# EAGLE schematic BMS Layout rev5 (EAGLE 9.2.2)
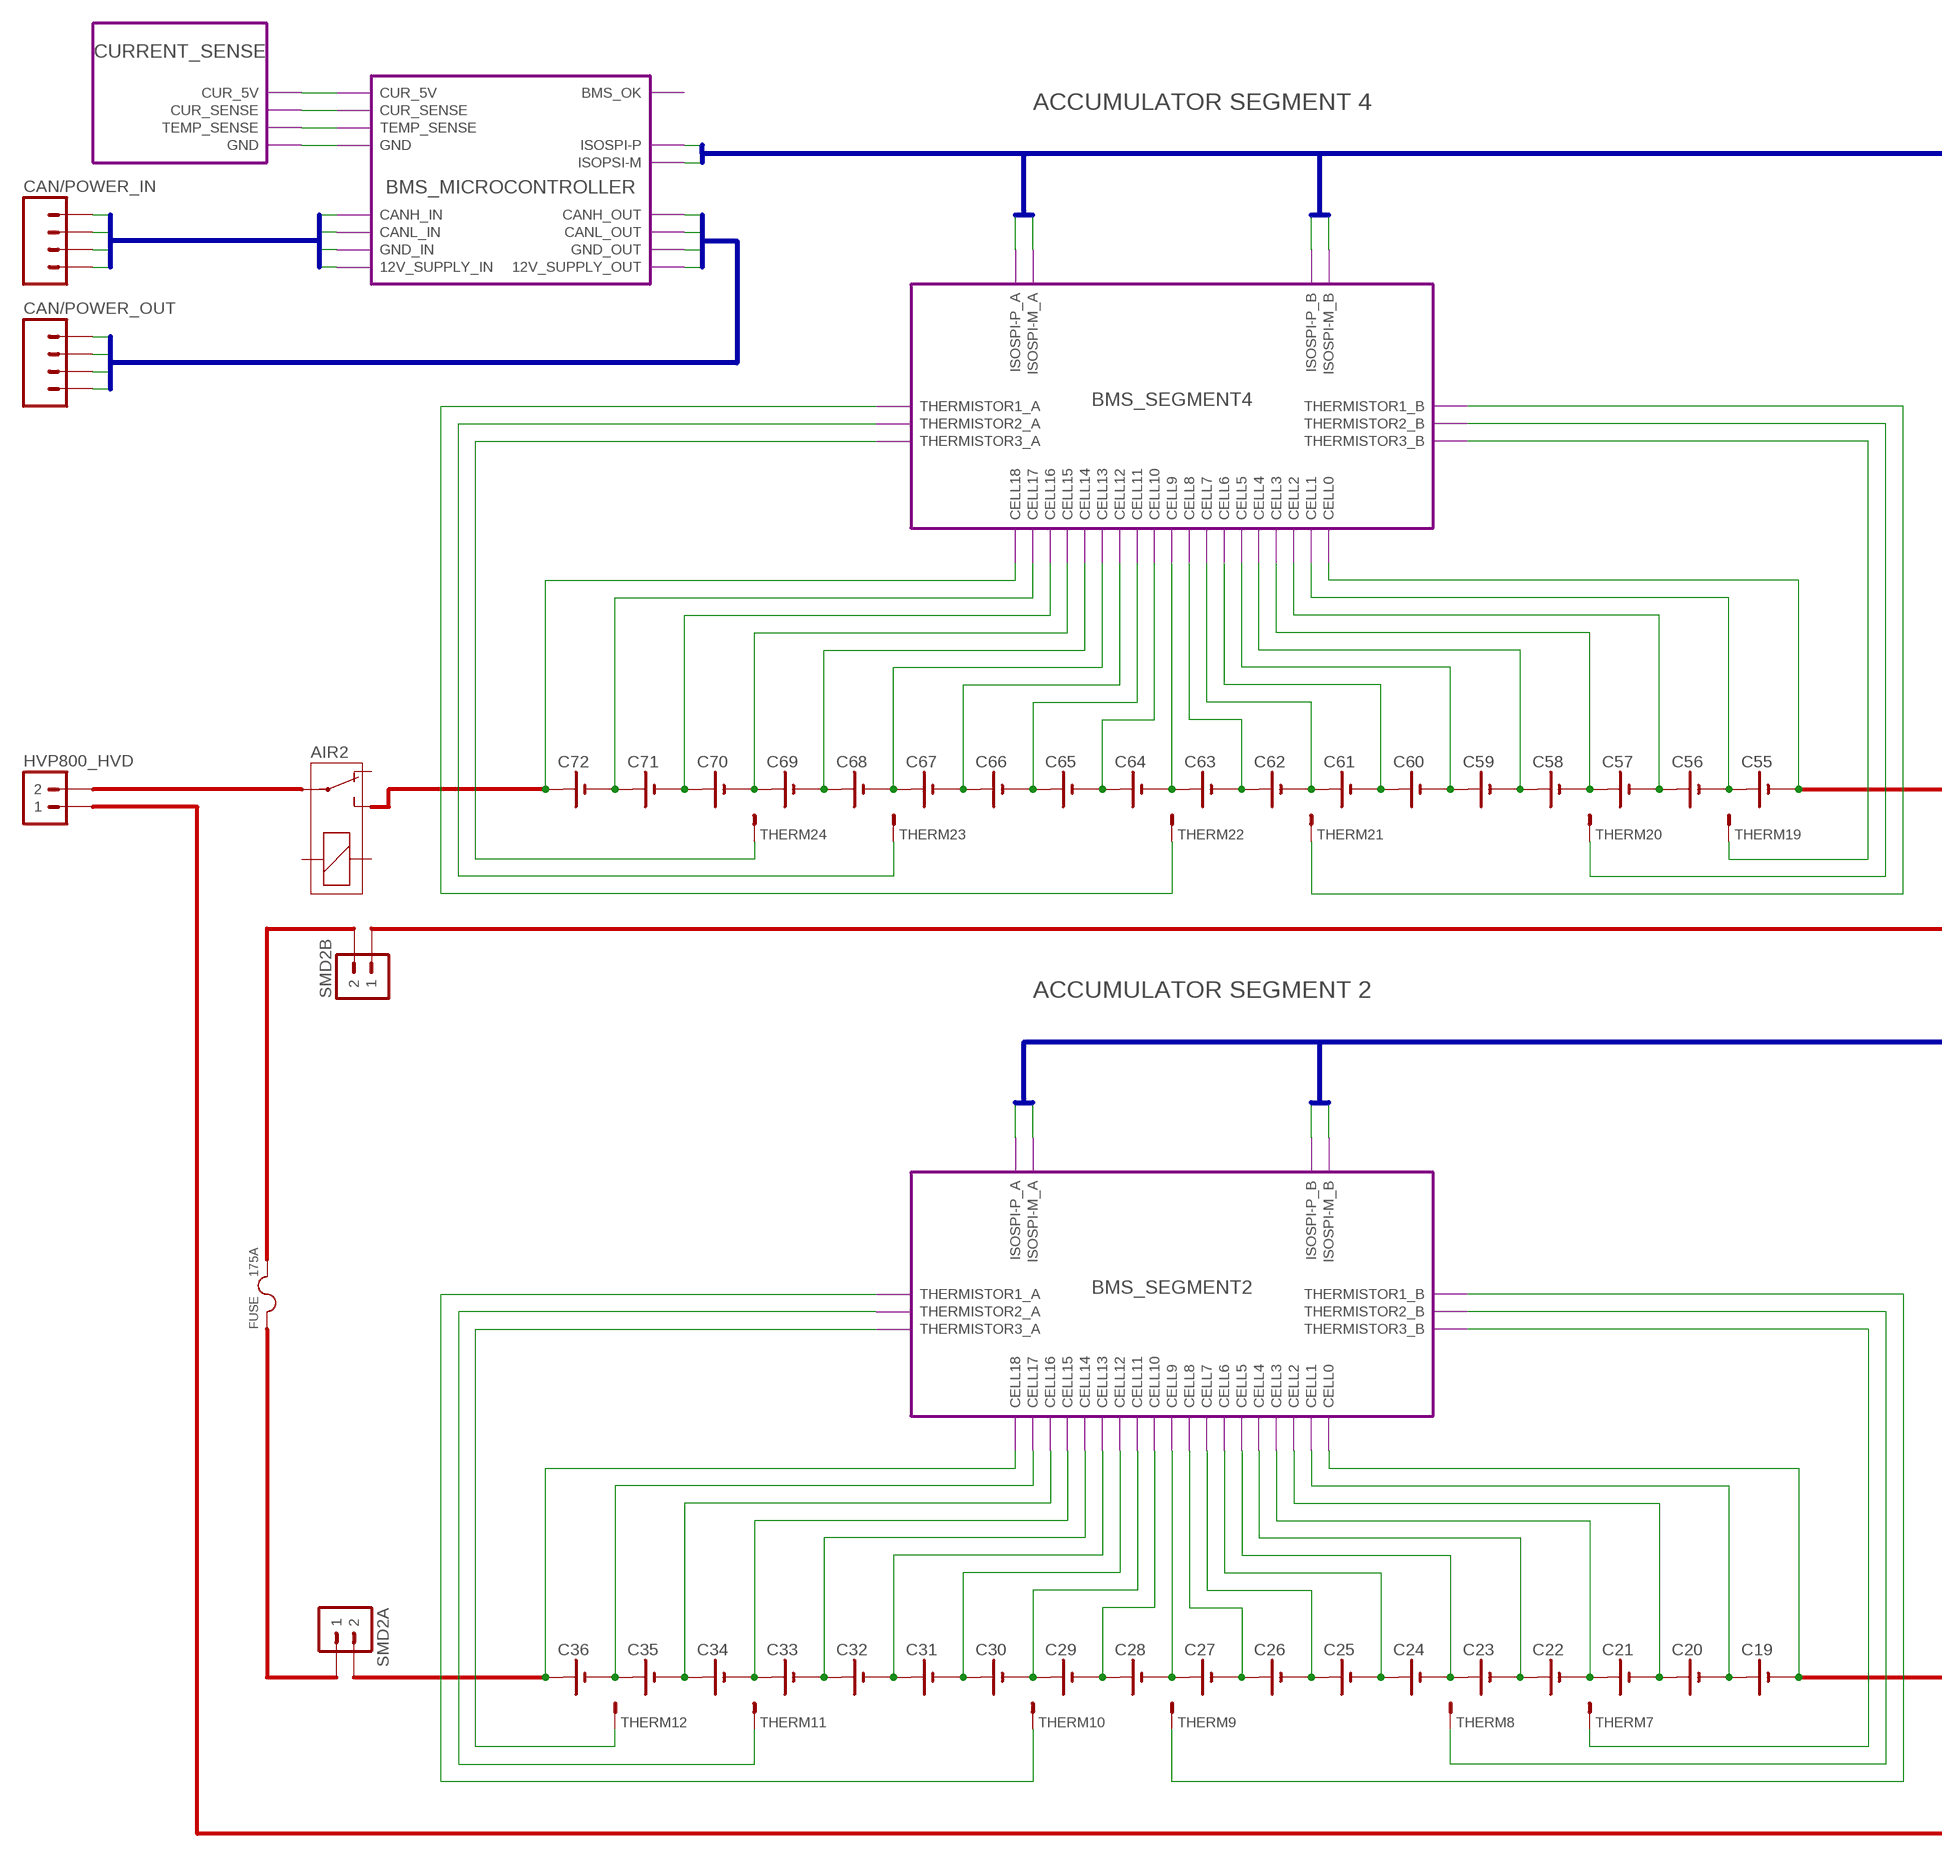
[diagram p0: schematic, sheet 1, part 1 of 2]
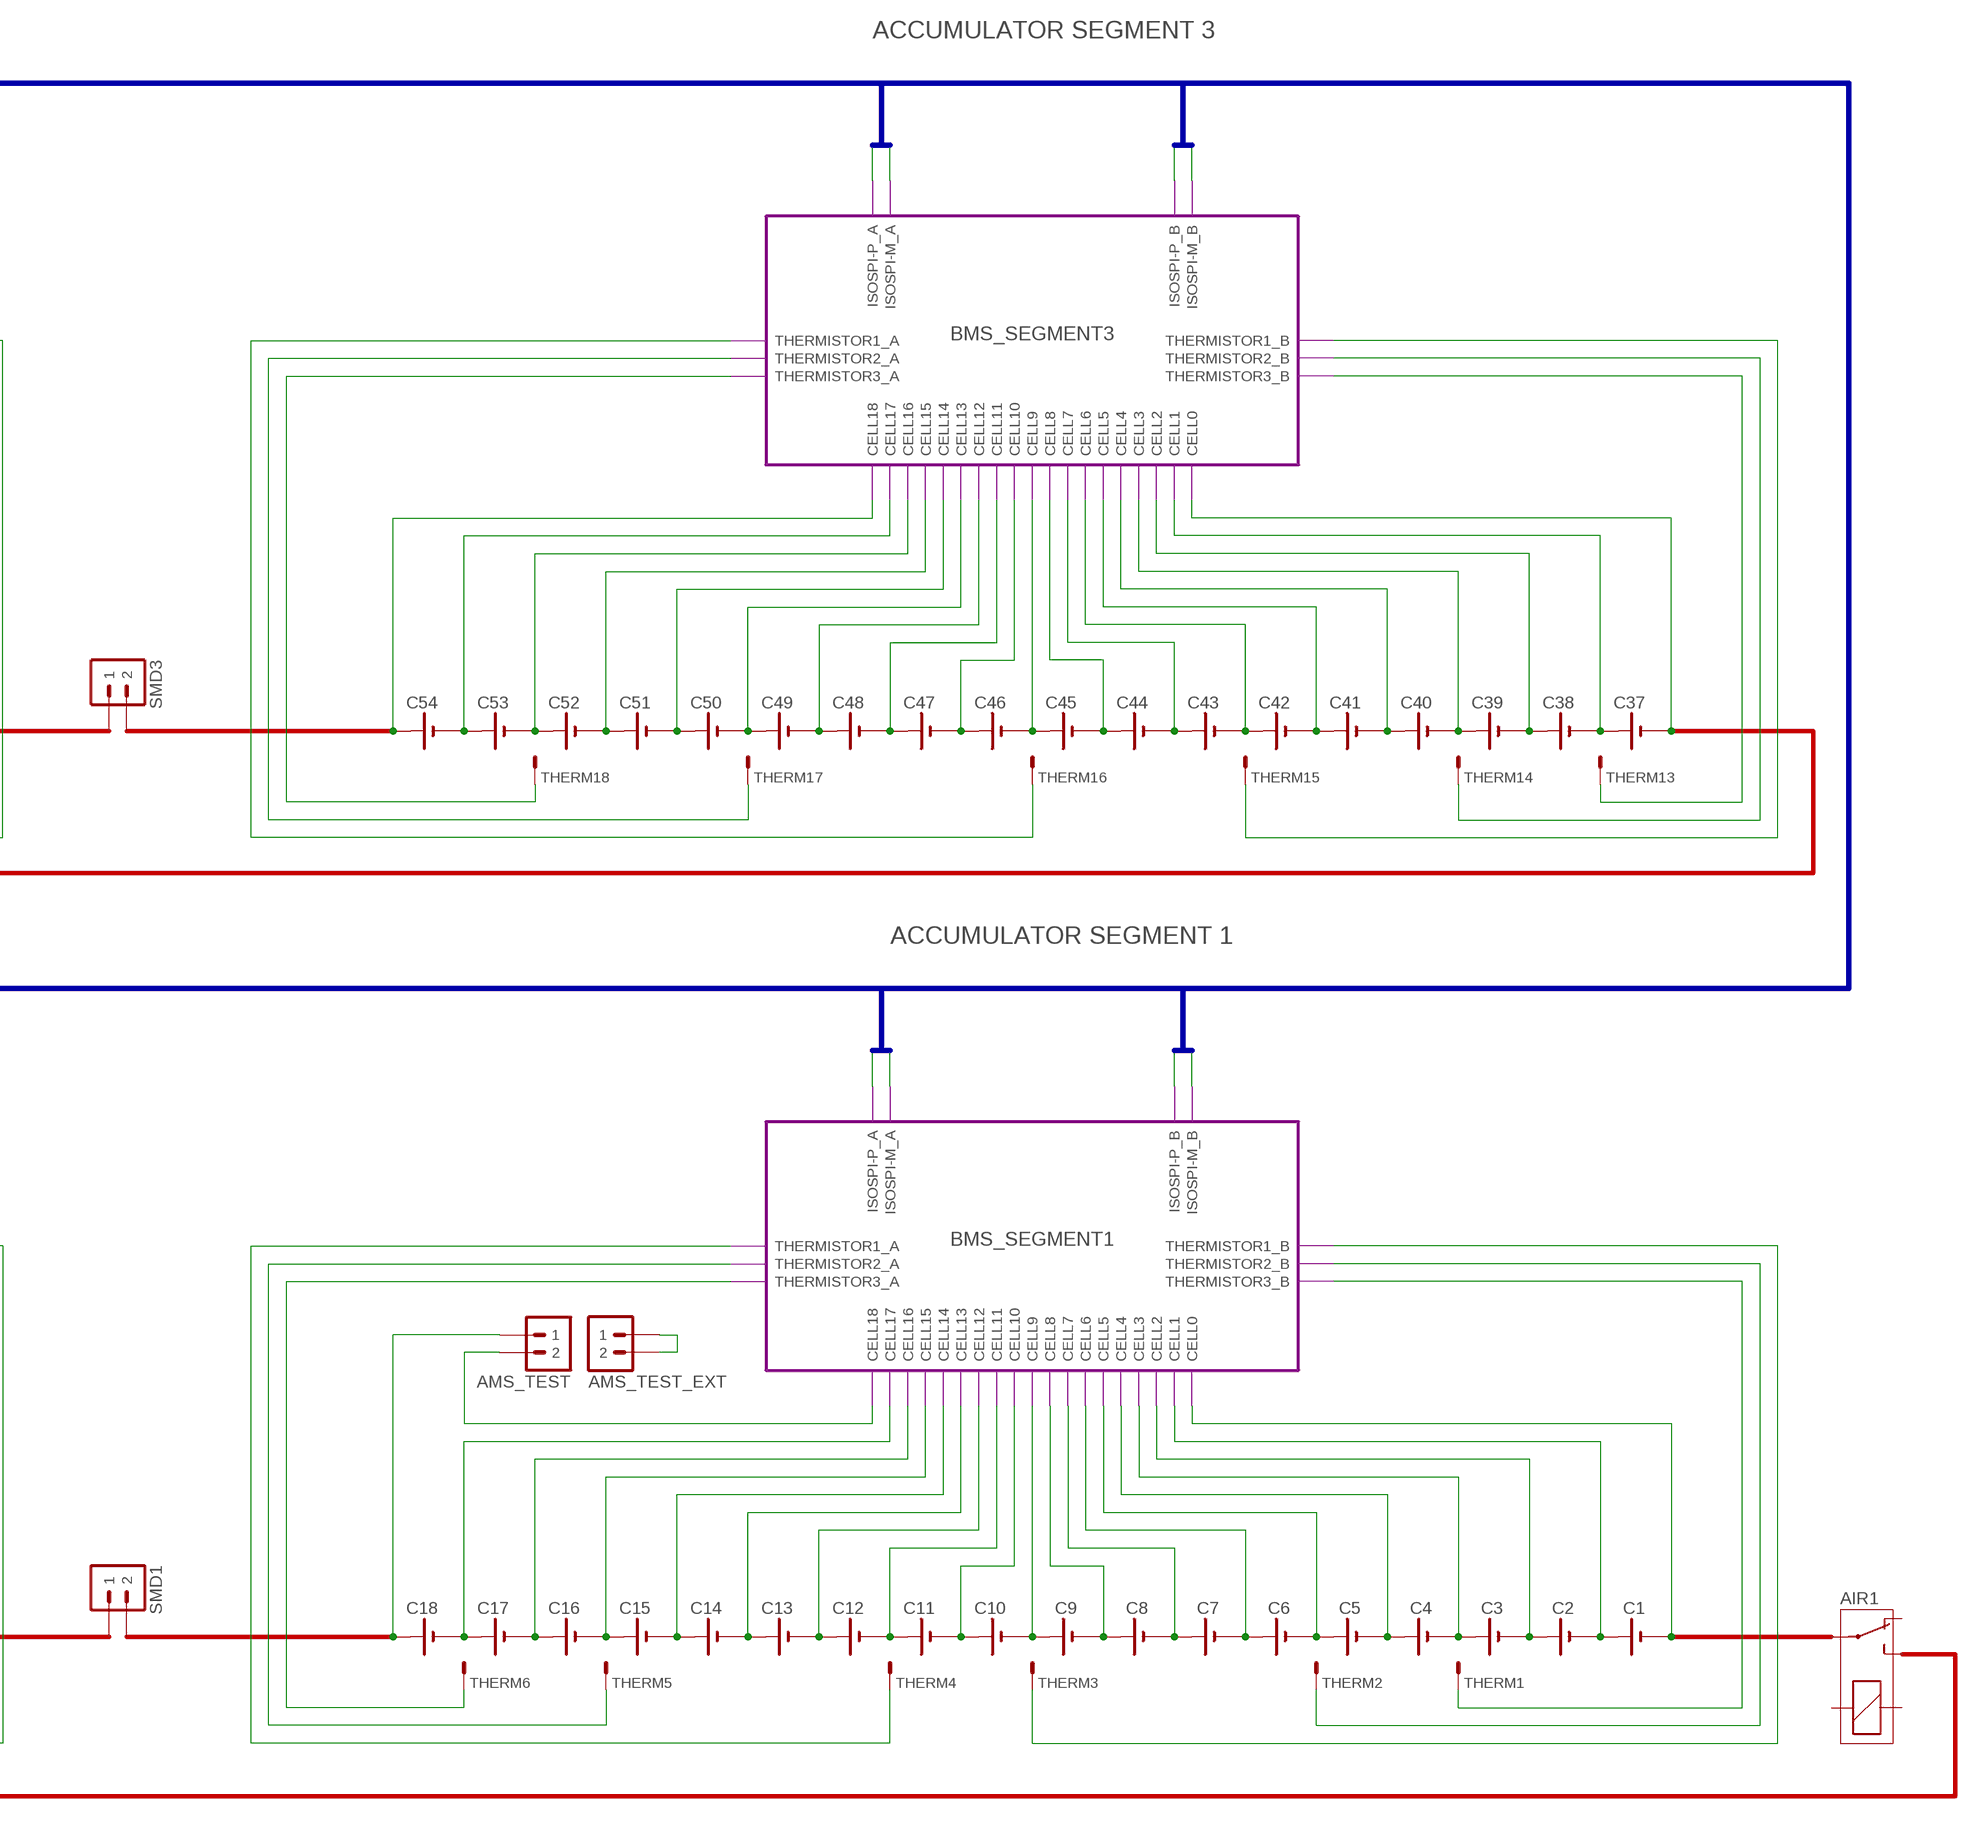
[diagram p1: schematic, sheet 1, part 2 of 2]

## Parts
AIR1  RELAY  (no package)
AIR2  RELAY  (no package)
AMS_TEST  M02  (no package)
AMS_TEST_EXT  M02  (no package)
C1  BATTERY_1_CELL  (no package)
C2  BATTERY_1_CELL  (no package)
C3  BATTERY_1_CELL  (no package)
C4  BATTERY_1_CELL  (no package)
C5  BATTERY_1_CELL  (no package)
C6  BATTERY_1_CELL  (no package)
C7  BATTERY_1_CELL  (no package)
C8  BATTERY_1_CELL  (no package)
C9  BATTERY_1_CELL  (no package)
C10  BATTERY_1_CELL  (no package)
C11  BATTERY_1_CELL  (no package)
C12  BATTERY_1_CELL  (no package)
C13  BATTERY_1_CELL  (no package)
C14  BATTERY_1_CELL  (no package)
C15  BATTERY_1_CELL  (no package)
C16  BATTERY_1_CELL  (no package)
C17  BATTERY_1_CELL  (no package)
C18  BATTERY_1_CELL  (no package)
C19  BATTERY_1_CELL  (no package)
C20  BATTERY_1_CELL  (no package)
C21  BATTERY_1_CELL  (no package)
C22  BATTERY_1_CELL  (no package)
C23  BATTERY_1_CELL  (no package)
C24  BATTERY_1_CELL  (no package)
C25  BATTERY_1_CELL  (no package)
C26  BATTERY_1_CELL  (no package)
C27  BATTERY_1_CELL  (no package)
C28  BATTERY_1_CELL  (no package)
C29  BATTERY_1_CELL  (no package)
C30  BATTERY_1_CELL  (no package)
C31  BATTERY_1_CELL  (no package)
C32  BATTERY_1_CELL  (no package)
C33  BATTERY_1_CELL  (no package)
C34  BATTERY_1_CELL  (no package)
C35  BATTERY_1_CELL  (no package)
C36  BATTERY_1_CELL  (no package)
C37  BATTERY_1_CELL  (no package)
C38  BATTERY_1_CELL  (no package)
C39  BATTERY_1_CELL  (no package)
C40  BATTERY_1_CELL  (no package)
C41  BATTERY_1_CELL  (no package)
C42  BATTERY_1_CELL  (no package)
C43  BATTERY_1_CELL  (no package)
C44  BATTERY_1_CELL  (no package)
C45  BATTERY_1_CELL  (no package)
C46  BATTERY_1_CELL  (no package)
C47  BATTERY_1_CELL  (no package)
C48  BATTERY_1_CELL  (no package)
C49  BATTERY_1_CELL  (no package)
C50  BATTERY_1_CELL  (no package)
C51  BATTERY_1_CELL  (no package)
C52  BATTERY_1_CELL  (no package)
C53  BATTERY_1_CELL  (no package)
C54  BATTERY_1_CELL  (no package)
C55  BATTERY_1_CELL  (no package)
C56  BATTERY_1_CELL  (no package)
C57  BATTERY_1_CELL  (no package)
C58  BATTERY_1_CELL  (no package)
C59  BATTERY_1_CELL  (no package)
C60  BATTERY_1_CELL  (no package)
C61  BATTERY_1_CELL  (no package)
C62  BATTERY_1_CELL  (no package)
C63  BATTERY_1_CELL  (no package)
C64  BATTERY_1_CELL  (no package)
C65  BATTERY_1_CELL  (no package)
C66  BATTERY_1_CELL  (no package)
C67  BATTERY_1_CELL  (no package)
C68  BATTERY_1_CELL  (no package)
C69  BATTERY_1_CELL  (no package)
C70  BATTERY_1_CELL  (no package)
C71  BATTERY_1_CELL  (no package)
C72  BATTERY_1_CELL  (no package)
CAN/POWER_IN  M04  (no package)
CAN/POWER_OUT  M04  (no package)
FUSE  175A  FUSE  (no package)
HVP800_HVD  M02  (no package)
SMD1  M02  (no package)
SMD2A  M02  (no package)
SMD2B  M02  (no package)
SMD3  M02  (no package)
THERM1  THERMISTOR  (no package)
THERM2  THERMISTOR  (no package)
THERM3  THERMISTOR  (no package)
THERM4  THERMISTOR  (no package)
THERM5  THERMISTOR  (no package)
THERM6  THERMISTOR  (no package)
THERM7  THERMISTOR  (no package)
THERM8  THERMISTOR  (no package)
THERM9  THERMISTOR  (no package)
THERM10  THERMISTOR  (no package)
THERM11  THERMISTOR  (no package)
THERM12  THERMISTOR  (no package)
THERM13  THERMISTOR  (no package)
THERM14  THERMISTOR  (no package)
THERM15  THERMISTOR  (no package)
THERM16  THERMISTOR  (no package)
THERM17  THERMISTOR  (no package)
THERM18  THERMISTOR  (no package)
THERM19  THERMISTOR  (no package)
THERM20  THERMISTOR  (no package)
THERM21  THERMISTOR  (no package)
THERM22  THERMISTOR  (no package)
THERM23  THERMISTOR  (no package)
THERM24  THERMISTOR  (no package)

## Module instances
BMS_SEGMENT4 = BMS_SEGMENT
BMS_SEGMENT3 = BMS_SEGMENT
BMS_SEGMENT2 = BMS_SEGMENT
BMS_SEGMENT1 = BMS_SEGMENT
BMS_MICROCONTROLLER = BMS_MICROCONTROLLER
CURRENT_SENSE = CURRENT_SENSE

## Nets
B$3: port BMS_MICROCONTROLLER.ISOSPI-P BMS_MICROCONTROLLER.ISOPSI-M
B$5: port BMS_MICROCONTROLLER.CANH_IN BMS_MICROCONTROLLER.CANL_IN BMS_MICROCONTROLLER.GND_IN BMS_MICROCONTROLLER.12V_SUPPLY_IN
B$6: port BMS_MICROCONTROLLER.CANH_OUT BMS_MICROCONTROLLER.CANL_OUT BMS_MICROCONTROLLER.GND_OUT BMS_MICROCONTROLLER.12V_SUPPLY_OUT
B$7: CAN/POWER_IN.1 CAN/POWER_IN.2 CAN/POWER_IN.3 CAN/POWER_IN.4
B$8: CAN/POWER_OUT.1 CAN/POWER_OUT.2 CAN/POWER_OUT.3 CAN/POWER_OUT.4
ISOSPI: port BMS_SEGMENT4.ISOSPI-P_A BMS_SEGMENT4.ISOSPI-M_A BMS_SEGMENT4.ISOSPI-P_B BMS_SEGMENT4.ISOSPI-M_B BMS_SEGMENT3.ISOSPI-P_A BMS_SEGMENT3.ISOSPI-M_A BMS_SEGMENT3.ISOSPI-P_B BMS_SEGMENT3.ISOSPI-M_B BMS_SEGMENT2.ISOSPI-P_A BMS_SEGMENT2.ISOSPI-M_A BMS_SEGMENT2.ISOSPI-P_B BMS_SEGMENT2.ISOSPI-M_B BMS_SEGMENT1.ISOSPI-P_A BMS_SEGMENT1.ISOSPI-M_A BMS_SEGMENT1.ISOSPI-P_B BMS_SEGMENT1.ISOSPI-M_B
N$1: port BMS_MICROCONTROLLER.CUR_5V CURRENT_SENSE.CUR_5V
N$2: port BMS_MICROCONTROLLER.CUR_SENSE CURRENT_SENSE.CUR_SENSE
N$3: port BMS_MICROCONTROLLER.TEMP_SENSE CURRENT_SENSE.TEMP_SENSE
N$4: port BMS_MICROCONTROLLER.GND CURRENT_SENSE.GND
N$5: C53.+ C54.- ; port BMS_SEGMENT3.CELL17
N$6: C52.+ C53.- ; port BMS_SEGMENT3.CELL16
N$7: C13.+ C14.- ; port BMS_SEGMENT1.CELL13
N$8: C8.+ C9.- ; port BMS_SEGMENT1.CELL8
N$9: C51.+ C52.- ; port BMS_SEGMENT3.CELL15
N$10: C55.- ; port BMS_SEGMENT4.CELL0
N$11: C50.+ C51.- ; port BMS_SEGMENT3.CELL14
N$12: C49.+ C50.- ; port BMS_SEGMENT3.CELL13
N$13: C48.+ C49.- ; port BMS_SEGMENT3.CELL12
N$14: C47.+ C48.- ; port BMS_SEGMENT3.CELL11
N$15: C72.+ ; port BMS_SEGMENT4.CELL18
N$16: C62.+ C63.- ; port BMS_SEGMENT4.CELL8
N$17: C61.+ C62.- ; port BMS_SEGMENT4.CELL7
N$18: C60.+ C61.- ; port BMS_SEGMENT4.CELL6
N$19: C71.+ C72.- ; port BMS_SEGMENT4.CELL17
N$20: C59.+ C60.- ; port BMS_SEGMENT4.CELL5
N$21: C70.+ C71.- ; port BMS_SEGMENT4.CELL16
N$22: C58.+ C59.- ; port BMS_SEGMENT4.CELL4
N$23: C57.+ C58.- ; port BMS_SEGMENT4.CELL3
N$24: C56.+ C57.- ; port BMS_SEGMENT4.CELL2
N$25: C55.+ C56.- ; port BMS_SEGMENT4.CELL1
N$26: C69.+ C70.- ; port BMS_SEGMENT4.CELL15
N$27: C46.+ C47.- ; port BMS_SEGMENT3.CELL10
N$28: C17.+ C18.- ; port BMS_SEGMENT1.CELL17
N$29: C35.+ C36.- ; port BMS_SEGMENT2.CELL17
N$30: C34.+ C35.- ; port BMS_SEGMENT2.CELL16
N$31: C33.+ C34.- ; port BMS_SEGMENT2.CELL15
N$32: C32.+ C33.- ; port BMS_SEGMENT2.CELL14
N$33: C68.+ C69.- ; port BMS_SEGMENT4.CELL14
N$34: C31.+ C32.- ; port BMS_SEGMENT2.CELL13
N$35: C30.+ C31.- ; port BMS_SEGMENT2.CELL12
N$36: C29.+ C30.- ; port BMS_SEGMENT2.CELL11
N$37: C67.+ C68.- ; port BMS_SEGMENT4.CELL13
N$38: C28.+ C29.- ; port BMS_SEGMENT2.CELL10
N$39: C26.+ C27.- ; port BMS_SEGMENT2.CELL8
N$40: C25.+ C26.- ; port BMS_SEGMENT2.CELL7
N$41: C66.+ C67.- ; port BMS_SEGMENT4.CELL12
N$42: C16.+ C17.- ; port BMS_SEGMENT1.CELL16
N$43: C15.+ C16.- ; port BMS_SEGMENT1.CELL15
N$44: C65.+ C66.- ; port BMS_SEGMENT4.CELL11
N$45: C14.+ C15.- ; port BMS_SEGMENT1.CELL14
N$46: C12.+ C13.- ; port BMS_SEGMENT1.CELL12
N$47: C64.+ C65.- ; port BMS_SEGMENT4.CELL10
N$48: C7.+ C8.- ; port BMS_SEGMENT1.CELL7
N$49: C6.+ C7.- ; port BMS_SEGMENT1.CELL6
N$50: C5.+ C6.- ; port BMS_SEGMENT1.CELL5
N$51: C45.+ C46.- ; port BMS_SEGMENT3.CELL9
N$52: C54.+ ; port BMS_SEGMENT3.CELL18
N$53: C44.+ C45.- ; port BMS_SEGMENT3.CELL8
N$54: C63.+ C64.- ; port BMS_SEGMENT4.CELL9
N$55: C43.+ C44.- ; port BMS_SEGMENT3.CELL7
N$56: C42.+ C43.- ; port BMS_SEGMENT3.CELL6
N$57: C41.+ C42.- ; port BMS_SEGMENT3.CELL5
N$58: C40.+ C41.- ; port BMS_SEGMENT3.CELL4
N$59: C39.+ C40.- ; port BMS_SEGMENT3.CELL3
N$60: C38.+ C39.- ; port BMS_SEGMENT3.CELL2
N$61: C37.+ C38.- ; port BMS_SEGMENT3.CELL1
N$62: C37.- ; port BMS_SEGMENT3.CELL0
N$63: THERM22.S ; port BMS_SEGMENT4.THERMISTOR1_A
N$64: THERM23.S ; port BMS_SEGMENT4.THERMISTOR2_A
N$65: THERM24.S ; port BMS_SEGMENT4.THERMISTOR3_A
N$66: THERM21.S ; port BMS_SEGMENT4.THERMISTOR1_B
N$67: THERM20.S ; port BMS_SEGMENT4.THERMISTOR2_B
N$68: THERM19.S ; port BMS_SEGMENT4.THERMISTOR3_B
N$69: THERM16.S ; port BMS_SEGMENT3.THERMISTOR1_A
N$70: THERM17.S ; port BMS_SEGMENT3.THERMISTOR2_A
N$71: THERM18.S ; port BMS_SEGMENT3.THERMISTOR3_A
N$72: THERM15.S ; port BMS_SEGMENT3.THERMISTOR1_B
N$73: THERM14.S ; port BMS_SEGMENT3.THERMISTOR2_B
N$74: THERM13.S ; port BMS_SEGMENT3.THERMISTOR3_B
N$75: C24.+ C25.- ; port BMS_SEGMENT2.CELL6
N$76: THERM12.S ; port BMS_SEGMENT2.THERMISTOR3_A
N$77: C22.+ C23.- ; port BMS_SEGMENT2.CELL4
N$78: C21.+ C22.- ; port BMS_SEGMENT2.CELL3
N$79: C20.+ C21.- ; port BMS_SEGMENT2.CELL2
N$80: C19.+ C20.- ; port BMS_SEGMENT2.CELL1
N$81: C36.+ ; port BMS_SEGMENT2.CELL18
N$82: THERM11.S ; port BMS_SEGMENT2.THERMISTOR2_A
N$83: THERM10.S ; port BMS_SEGMENT2.THERMISTOR1_A
N$84: C27.+ C28.- ; port BMS_SEGMENT2.CELL9
N$85: C9.+ C10.- ; port BMS_SEGMENT1.CELL9
N$86: C11.+ C12.- ; port BMS_SEGMENT1.CELL11
N$87: C10.+ C11.- ; port BMS_SEGMENT1.CELL10
N$88: C23.+ C24.- ; port BMS_SEGMENT2.CELL5
N$89: THERM4.S ; port BMS_SEGMENT1.THERMISTOR1_A
N$90: THERM5.S ; port BMS_SEGMENT1.THERMISTOR2_A
N$91: THERM6.S ; port BMS_SEGMENT1.THERMISTOR3_A
N$92: AMS_TEST_EXT.1 AMS_TEST_EXT.2
N$93: C19.- ; port BMS_SEGMENT2.CELL0
N$94: C3.+ C4.- ; port BMS_SEGMENT1.CELL3
N$95: C2.+ C3.- ; port BMS_SEGMENT1.CELL2
N$96: C1.+ C2.- ; port BMS_SEGMENT1.CELL1
N$97: THERM1.S ; port BMS_SEGMENT1.THERMISTOR3_B
N$98: THERM2.S ; port BMS_SEGMENT1.THERMISTOR2_B
N$99: THERM9.S ; port BMS_SEGMENT2.THERMISTOR1_B
N$100: THERM8.S ; port BMS_SEGMENT2.THERMISTOR2_B
N$101: THERM7.S ; port BMS_SEGMENT2.THERMISTOR3_B
N$102: THERM3.S ; port BMS_SEGMENT1.THERMISTOR1_B
N$103: AMS_TEST.2 ; port BMS_SEGMENT1.CELL18
N$105: AMS_TEST.1 C18.+
N$108: C4.+ C5.- ; port BMS_SEGMENT1.CELL4
N$112: C1.- ; port BMS_SEGMENT1.CELL0
Unconnected: AIR1.1 AIR1.2 AIR1.O AIR1.P AIR1.S AIR2.1 AIR2.2 AIR2.O AIR2.P AIR2.S FUSE.1 FUSE.2 HVP800_HVD.1 HVP800_HVD.2 SMD1.1 SMD1.2 SMD2A.1 SMD2A.2 SMD2B.1 SMD2B.2 SMD3.1 SMD3.2

## Buses
ISOSPI
B$5
B$6
B$7
B$8

## Notes on the sheet
- ACCUMULATOR SEGMENT 4 | ACCUMULATOR SEGMENT 3
- ACCUMULATOR SEGMENT 2 | ACCUMULATOR SEGMENT 1

## Library data of the parts
AIR1 AIR2 = HyTechSymbols:RELAY: RELAY 1 x switch
AMS_TEST AMS_TEST_EXT HVP800_HVD SMD1 SMD2A SMD2B SMD3 = HyTechSymbols:M02: Generic 2-pin connector
C1-C72 = HyTechSymbols:BATTERY_1_CELL: Generic 1-cell battery Source: Sonnenschein
CAN/POWER_IN CAN/POWER_OUT = HyTechSymbols:M04: Generic 4-pin connector
FUSE = HyTechSymbols:FUSE: Generic Fuse
THERM1-THERM24 = HyTechSymbols:THERMISTOR

## Module BMS_SEGMENT
Ports: CELL1(in) CELL2(in) CELL3(in) CELL4(in) CELL5(in) CELL6(in) CELL7(in) CELL8(in) CELL9(in) ISOSPI-P_A(io) ISOSPI-M_A(io) ISOSPI-P_B(io) ISOSPI-M_B(io) THERMISTOR1_B(in) THERMISTOR2_B(in) THERMISTOR3_B(in) CELL10(in) CELL11(in) CELL12(in) CELL0(in) CELL13(in) CELL14(in) CELL15(in) CELL17(in) CELL18(in) CELL16(in) THERMISTOR1_A(in) THERMISTOR2_A(in) THERMISTOR3_A(in)

### Library data of the parts

## Module BMS_MICROCONTROLLER
Ports: ISOSPI-P(out) ISOPSI-M(out) 12V_SUPPLY_IN(in) GND_IN(in) CANL_IN(in) CANH_IN(in) 12V_SUPPLY_OUT(out) GND_OUT(out) CANL_OUT(out) CANH_OUT(out) BMS_OK(out) CUR_5V(out) CUR_SENSE(in) TEMP_SENSE(in) GND(in)

### Library data of the parts

## Module CURRENT_SENSE
Ports: CUR_5V(in) CUR_SENSE(out) TEMP_SENSE(out) GND(out)

### Library data of the parts